# Altium schematic sheet Sensor Board.SchDoc
size A3; SheetNumber: 5; SheetTotal: 5
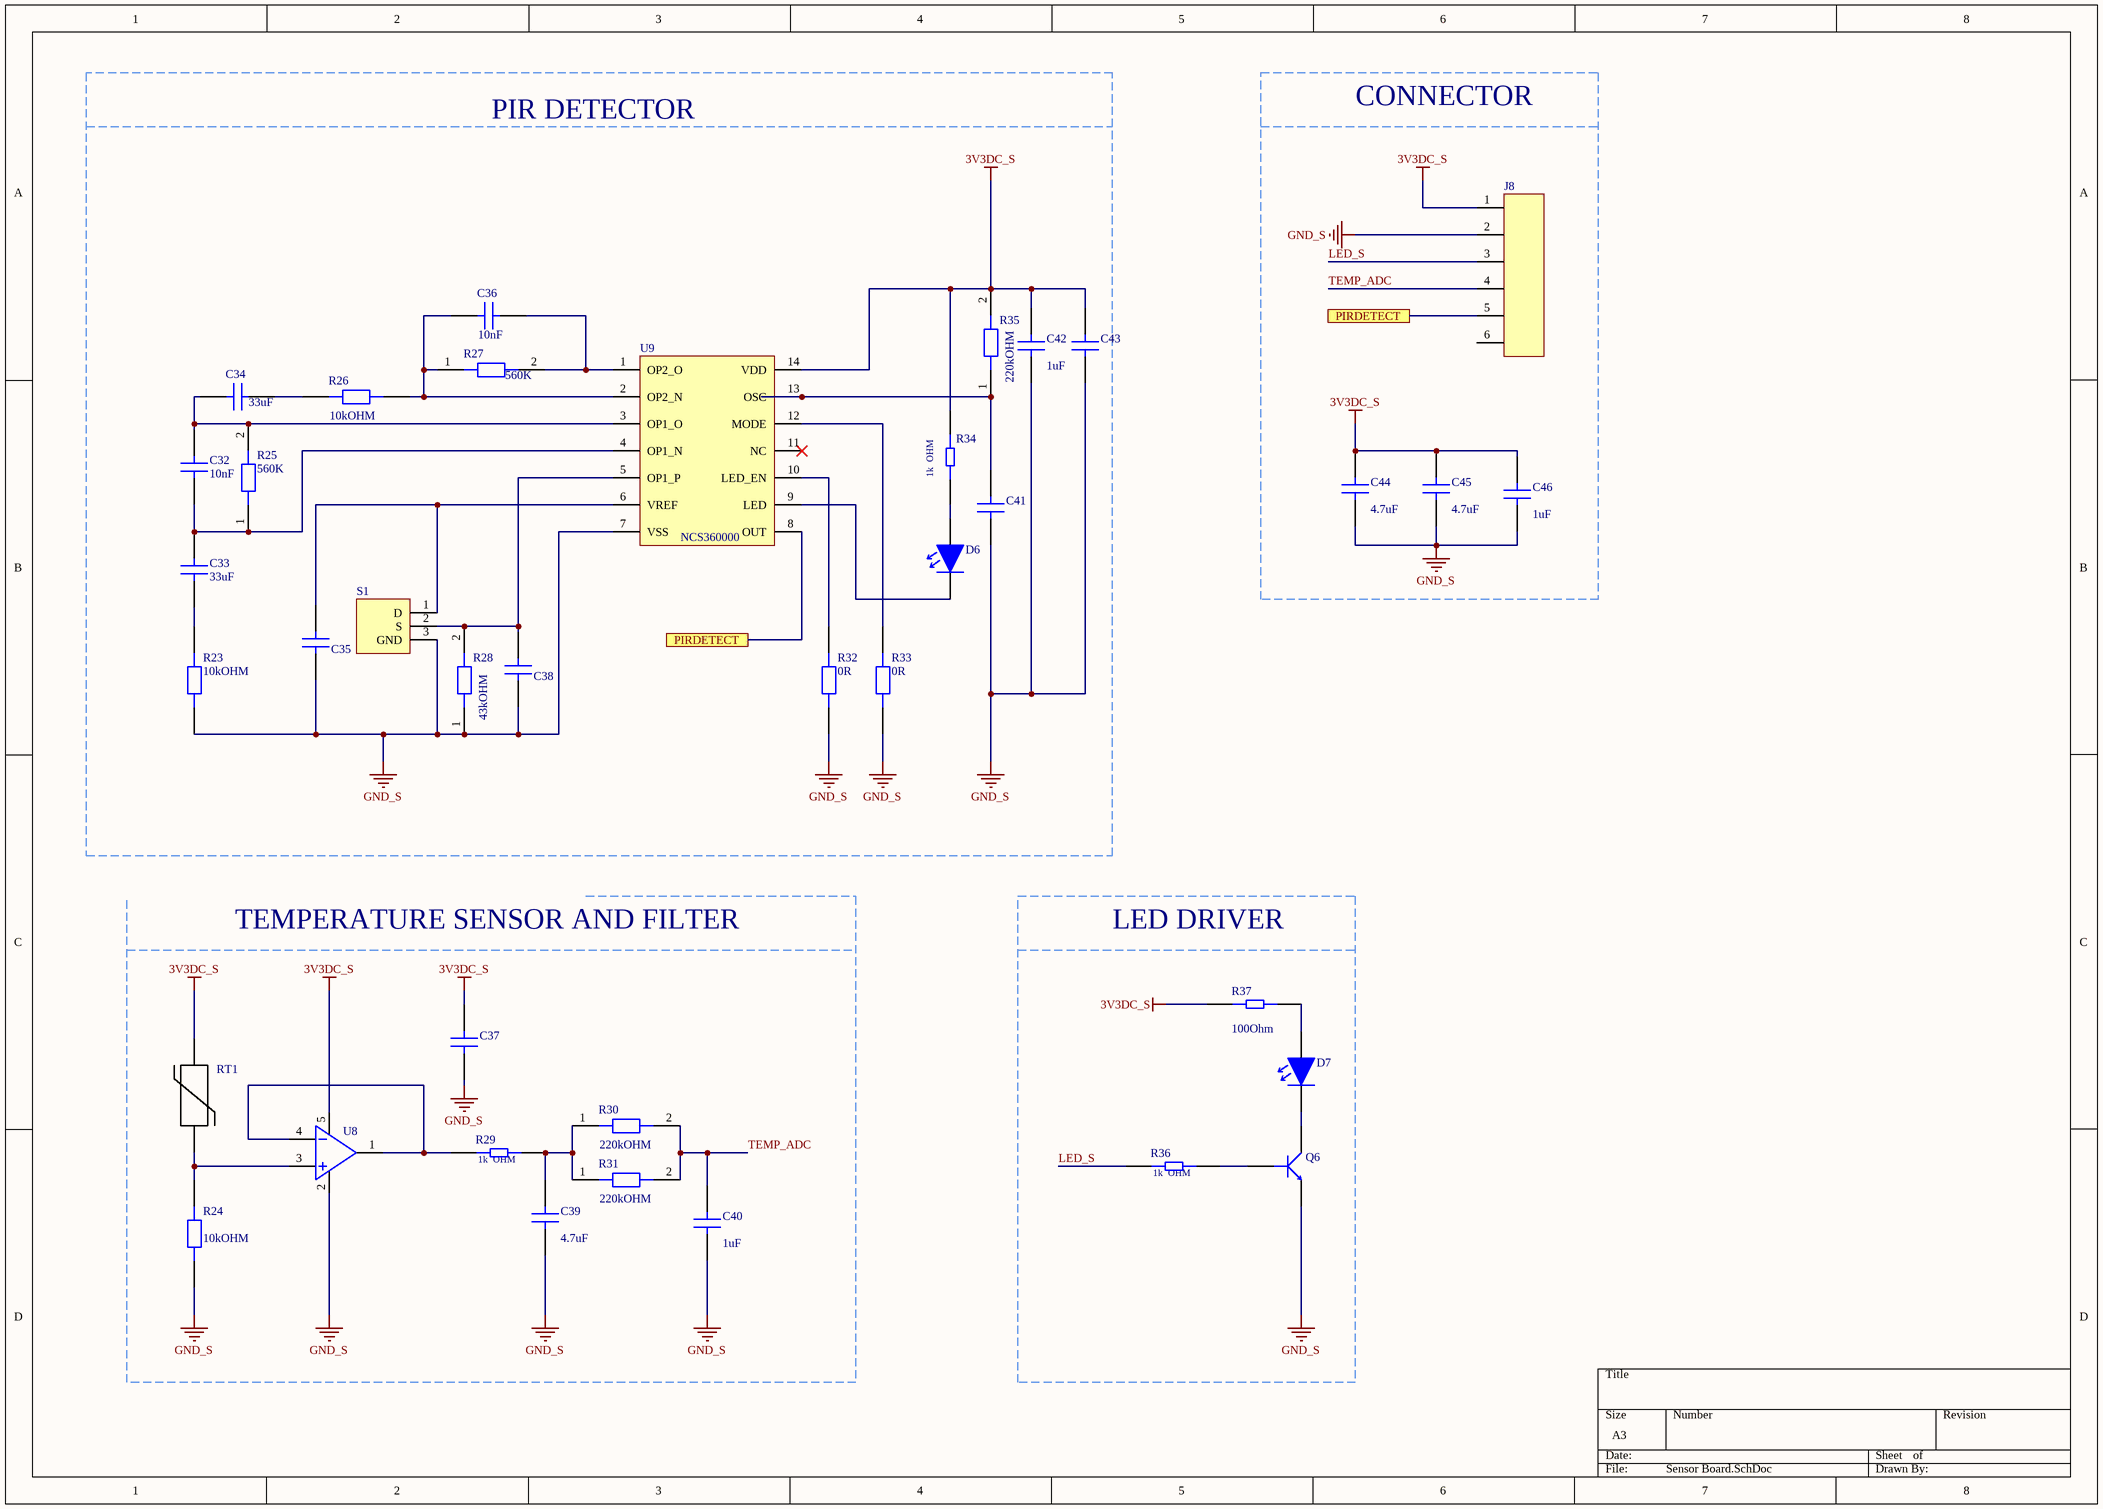
[diagram p0: Sensor Board.SchDoc]

## Parts
C32  Capacitance: 10nF  [CAP_0603]  (hidden comment: CAP CER 10nF 0603)
C33  Capacitance: 33uF  [CAP_1206]  (hidden comment: CAP CER 33uF 1206)
C34  Capacitance: 33uF  [CAP_1206]  (hidden comment: CAP CER 33uF 1206)
C35  CAP CER 100nF 0603  [CAP_0603]  (value not drawn)
C36  Capacitance: 10nF  [CAP_0603]  (hidden comment: CAP CER 10nF 0603)
C37  CAP CER 100nF 0603  [CAP_0603]  (value not drawn)
C38  CAP CER 100nF 0603  [CAP_0603]  (value not drawn)
C39  Cap: 4.7uF  [CAP 0805]  (hidden comment: CAP CER 4.7uF 0805)
C40  Cap: 1uF  [CAP 0805]  (hidden comment: CAP CER 1uF)
C41  CAP CER 100nF 0603  [CAP_0603]  (value not drawn)
C42  Cap: 1uF  [CAP 0805]  (hidden comment: CAP CER 1uF)
C43  CAP CER 100nF 0603  [CAP_0603]  (value not drawn)
C44  Cap: 4.7uF  [CAP 0805]  (hidden comment: CAP CER 4.7uF 0805)
C45  Cap: 4.7uF  [CAP 0805]  (hidden comment: CAP CER 4.7uF 0805)
C46  Cap: 1uF  [CAP 0805]  (hidden comment: CAP CER 1uF)
D6  LED GREEN 0805  [LED GREEN 0805]  (value not drawn)
D7  LED RED 0805  [LED RED 0805]  (value not drawn)
J8  64800611622_conn_6pin  [64800611622]  (value not drawn)
Q6  MMBT3904-7-F  [SOT-23F]  (value not drawn)
R23  Resistance: 10kOHM  [RES_0603]  (hidden comment: RES 10K OHM 0603)
R24  Resistance: 10kOHM  [RES_0603]  (hidden comment: RES 10K OHM 0603)
R25  RES: 560K  [RES_0603]  (hidden comment: RES 560K OHM 0603)
R26  Resistance: 10kOHM  [RES_0603]  (hidden comment: RES 10K OHM 0603)
R27  RES: 560K  [RES_0603]  (hidden comment: RES 560K OHM 0603)
R28  Resistance: 43kOHM  [RES_0603]  (hidden comment: RES 43K OHM 0603)
R29  Reisitance: 1k  OHM  [RES_0603]  (hidden comment: RES 1K OHM 0603)
R30  Resistance: 220kOHM  [RES_0603]  (hidden comment: RES 220K OHM 0603)
R31  Resistance: 220kOHM  [RES_0603]  (hidden comment: RES 220K OHM 0603)
R32  Resistance: 0R  [RES_0603]  (hidden comment: RES 0 OHM 0603)
R33  Resistance: 0R  [RES_0603]  (hidden comment: RES 0 OHM 0603)
R34  Reisitance: 1k  OHM  [RES_0603]  (hidden comment: RES 1K OHM 0603)
R35  Resistance: 220kOHM  [RES_0603]  (hidden comment: RES 220K OHM 0603)
R36  Reisitance: 1k  OHM  [RES_0603]  (hidden comment: RES 1K OHM 0603)
R37  Resistance: 100Ohm  [RES_0603]  (hidden comment: RES 100 OHM 0603)
RT1  TFPT 1206L 1002FM  [RES_1206]  (value not drawn)
S1  LHI 878/3902  [LHI 878]  (value not drawn)
U8  OPA314  [SOT23-5]  (value not drawn)
U9  NCS360000  [SOIC14]

## Blocks framed on the sheet
PIR DETECTOR: C32-C36 C38 C41-C43 D6 R23 R25-R28 R32-R35 S1 U9
CONNECTOR: C44-C46 J8
LED DRIVER: D7 Q6 R36 R37

## Ports
PIRDETECT (see Sensor Board[4900,6400]), PIRDETECT (see Sensor Board[9800,8800])

## Nets
3V3DC_S: C37.2 C42.2 C43.2 C44.2 C45.2 C46.2 J8.1 R34.2 R35.2 R37.1 RT1.2 U8.5 U9.14(VDD)
GND_S: C35.1 C37.1 C38.1 C39.1 C40.1 C41.2 C42.1 C43.1 C44.1 C45.1 C46.1 J8.2 Q6.2(E) R23.1 R24.1 R28.1 R32.1 R33.1 S1.3(GND) U8.2 U9.7(VSS)
LED_S: J8.3 R36.1
PIRDETECT: J8.5 U9.8(OUT) ; port PIRDETECT
TEMP_ADC: C40.2 J8.4 R30.2 R31.2
NetC32_1: C32.1 C33.2 R25.1 U9.4(OP1_N)
NetC32_2: C32.2 C34.1 R25.2 U9.3(OP1_O)
NetC33_1: C33.1 R23.2
NetC34_2: C34.2 R26.1
NetC35_2: C35.2 S1.1(D) U9.6(VREF)
NetC36_1: C36.1 R26.2 R27.1 U9.2(OP2_N)
NetC36_2: C36.2 R27.2 U9.1(OP2_O)
NetC38_2: C38.2 R28.2 S1.2(S) U9.5(OP1_P)
NetC39_2: C39.2 R29.2 R30.1 R31.1
NetC41_1: C41.1 R35.1 U9.13(OSC)
NetD6_1: D6.1 U9.9(LED)
NetD6_2: D6.2 R34.1
NetD7_1: D7.1 Q6.3(C)
NetD7_2: D7.2 R37.2
NetQ6_1: Q6.1(B) R36.2
NetR24_2: R24.2 RT1.1 U8.3
NetR29_1: R29.1 U8.1 U8.4
NetR32_2: R32.2 U9.10(LED_EN)
NetR33_2: R33.2 U9.12(MODE)

Not connected (* = marked no-connect by the designer): J8 6; U9 11(NC)*

## Notes on the sheet
- TEMPERATURE SENSOR AND FILTER

## Library data of the parts
C39 C44 C45 = CAP CER 4.7uF 0805: CAP CER 4.7UF 25V X5R 0805; Manufacturer: Samsung; Manufacturer Part Number: CL21A475KAQNNNE; Supplier 1: Arrow Electronics; RoHS: Yes; Category: Ceramic Capacitors; Stock 1: 906000; Pricing 1: 2000=0.0173, 4000=0.0169, 10000=0.0146, 14000=0.0133, 50000=0.0114, 100000=0.0096, 200000=0.0089 (USD); ComponentLink1URL: https://datasheet.ciiva.com/25798/cl21a475kaqnnne-25798882.pdf?src-supplier=Digi-Key; ComponentLink1Description: https://datasheet.ciiva.com/25798/cl21a475kaqnnne-25798882.pdf?src-supplier=Digi-Key; Supplier Part Number 1: CL21A475KAQNNNE
R32 R33 = RES 0 OHM 0603: Res Metal Strip 0603 0 Ohm Sulfur Resistant Pad SMD Automotive T/R; Manufacturer: Vishay Dale; Manufacturer Part Number: WSL060300000ZEA9; Temperature Coefficient: 3900ppm/°C; Supplier 1: Mouser; RoHS: Yes; Category: Chip SMD Resistors; Stock 1: 50899; Pricing 1: 1=1.09, 10=0.846, 50=0.846, 100=0.699, 1000=0.433, 10000=0.402 (USD); Case/Package: 0603; Case Code (Imperial): 0603; Case Code (Metric): 1608; Contact Plating: Tin,Matte; Min Operating Temperature: -65°C; Max Operating Temperature: 170°C; Packaging: Cut Tape; Series: WSL; Number of Terminations: 2; RoHS Compliant: Yes; ComponentLink1URL: http://www.mouser.com/ds/2/427/wsl-101914.pdf?src-supplier=Mouser; ComponentLink1Description: http://www.mouser.com/ds/2/427/wsl-101914.pdf?src-supplier=Mouser; ComponentLink2URL: http://www.vishay.com/docs/30100/wsl.pdf?src-supplier=Avnet; ComponentLink2Description: http://www.vishay.com/docs/30100/wsl.pdf?src-supplier=Avnet; ComponentLink3URL: http://www.vishay.com/docs/30192/wsl-9.pdf?src-supplier=Digi-Key; ComponentLink3Description: http://www.vishay.com/docs/30192/wsl-9.pdf?src-supplier=Digi-Key; Supplier Part Number 1: 71-WSL060300000ZEA9
RT1 = TFPT 1206L 1002FM: Thermistor PTC 10K Ohm 1% 2-Pin 1206 Surface Mount Solder Pad T/R Automotive; Manufacturer: Vishay Dale; Resistance: 10kR; Power Rating: 125mW; Voltage: 40V; Supplier 1: Mouser; Manufacturer Part Number: TFPT1206L1002FM; RoHS: Yes; Category: Thermistors; Stock 1: 7122; Pricing 1: 1=1.34, 10=1.05, 50=1.05, 100=0.714, 1000=0.53, 10000=0.453 (USD); Mount: Surface Mount; Case/Package: 1206; Case Code (Imperial): 1206; Min Operating Temperature: -55°C; Max Operating Temperature: 125°C; Packaging: Tape and Reel; Package Quantity: 5000; Tolerance: 1%; Max Power Dissipation: 125mW; Termination: SMD/SMT; Series: TFPT; Resistance Tolerance: 1%; Length: 3.2mm; Width: 1.6mm; Height: 0.55mm; Lead Free: Lead Free; RoHS Compliant: Yes; ComponentLink1URL: https://datasheet.ciiva.com/2852/tfpt-2852076.pdf?src-supplier=Digi-Key; ComponentLink1Description: https://datasheet.ciiva.com/2852/tfpt-2852076.pdf?src-supplier=Digi-Key; Supplier Part Number 1: 71-TFPT1206L1002FM
S1 = LHI 878/3902: MAX Supply Voltage: 12; MIN Supply Voltage: 2
U8 = OPA314: IC OPAMP GP 3MHZ RRO SOT23-5; Manufacturer: Texas Instruments; Manufacturer Part Number: OPA314AIDBVR; Supplier 1: Digi-Key; RoHS: Yes; Category: Amplifiers - Op Amps, Buffer, Instrumentation; Stock 1: 278; Pricing 1: 1=1.19, 10=1.065, 25=1.0104, 100=0.83, 250=0.77588, 500=0.68568, 1000=0.54132 (USD); ComponentLink1URL: https://datasheet.ciiva.com/14456/opa2314-14456281.pdf?src-supplier=Avnet; ComponentLink1Description: https://datasheet.ciiva.com/14456/opa2314-14456281.pdf?src-supplier=Avnet; ComponentLink2URL: https://datasheet.ciiva.com/14462/opa2314-14462006.pdf?src-supplier=Avnet; ComponentLink2Description: https://datasheet.ciiva.com/14462/opa2314-14462006.pdf?src-supplier=Avnet; ComponentLink3URL: https://datasheet.ciiva.com/29638/opa314-29638827.pdf?src-supplier=Digi-Key; ComponentLink3Description: https://datasheet.ciiva.com/29638/opa314-29638827.pdf?src-supplier=Digi-Key; Supplier Part Number 1: 296-36699-1-ND
U9 = NCS360000: NCS36000 Series Single 5.5V Passive Infrared Detector Controller (PIR) - SOIC-14; Manufacturer: ON Semiconductor; Manufacturer Part Number: NCS36000DG; Supplier 1: Avnet; RoHS: Yes; Category: Amplifiers - Op Amps, Buffer, Instrumentation; Stock 1: 1785; Pricing 1: 55=0.582, 60=0.56648, 120=0.55096, 280=0.53544, 550=0.51992 (USD); ComponentLink1URL: https://datasheet.ciiva.com/25629/0900766b810de37b-25629154.pdf?src-supplier=Rs; ComponentLink1Description: https://datasheet.ciiva.com/25629/0900766b810de37b-25629154.pdf?src-supplier=Rs; ComponentLink2URL: https://datasheet.ciiva.com/2965/ncs36000-d-2965211.pdf?src-supplier=Avnet; ComponentLink2Description: https://datasheet.ciiva.com/2965/ncs36000-d-2965211.pdf?src-supplier=Avnet; ComponentLink3URL: https://datasheet.ciiva.com/1782/ncs36000-d-1782043.pdf?src-supplier=Digi-Key; ComponentLink3Description: https://datasheet.ciiva.com/1782/ncs36000-d-1782043.pdf?src-supplier=Digi-Key; Supplier Part Number 1: NCS36000DG
C35 C37 C38 C41 C43 = CAP CER 100nF 0603: Case/Package: 0603